# Altium project BartelsInterface.PrjPcb
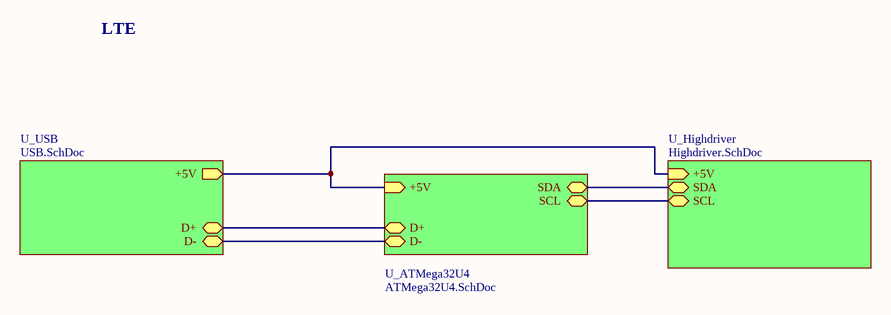
[diagram p0: Main.SchDoc]
4 sheets, 36 parts. Net scope: hierarchical (ports join the sheet entries above them; power ports are global).
Board file: PumpInterface.PcbDoc
Sheets:
  Main.SchDoc
    U_USB = USB.SchDoc
    U_ATMega32U4 = ATMega32U4.SchDoc
    U_Highdriver = Highdriver.SchDoc

## Sheet Main.SchDoc
size A4; SheetNumber: 1; SheetTotal: 4

### Parts
Bartunik  Gültig ab 5.3.18!!!  [lteLogoNeu_6mm]  (value not drawn)  (no BOM)

### Sub-sheets
U_ATMega32U4 = ATMega32U4.SchDoc: D+ (bidir), D- (bidir), SDA (bidir), SCL (bidir), +5V (in)
U_Highdriver = Highdriver.SchDoc: SCL (bidir), +5V (in), SDA (bidir)
U_USB = USB.SchDoc: D+ (bidir), D- (bidir), +5V (out)

### Nets
NetC_1.2_2: sheet U_USB/+5V, sheet U_ATMega32U4/+5V, sheet U_Highdriver/+5V
NetHeader1-14_5: sheet U_ATMega32U4/SDA, sheet U_Highdriver/SDA
NetHeader1-14_6: sheet U_ATMega32U4/SCL, sheet U_Highdriver/SCL
NetR_1.3_2: sheet U_USB/D+, sheet U_ATMega32U4/D+
NetR_1.4_2: sheet U_USB/D-, sheet U_ATMega32U4/D-

### Library data of the parts
Bartunik = ltelogoNEU: Manufactor: LTE; Part Number: ltelogoNEU; Supplier 1: LTE

## Sheet USB.SchDoc
size A4; SheetNumber: 3; SheetTotal: 4
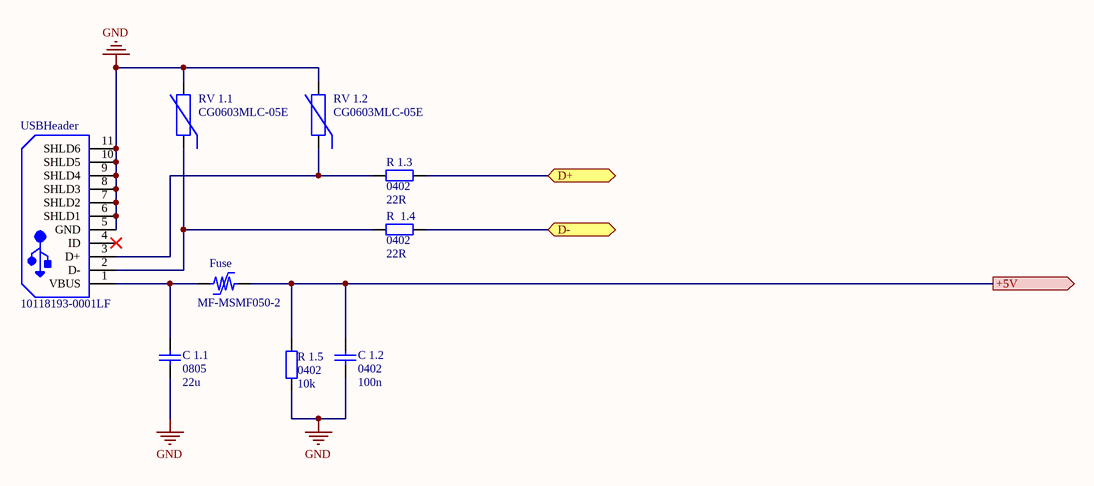
[diagram p1: USB.SchDoc]

### Parts
C_1.1  0805  value 22u  [C0805_M]
C_1.2  0402  value 100n  [C0402_M]
Fuse  MF-MSMF050-2  [BOUR-MF-MSMF050-2_V]
R_1.3  0402  value 22R  [R0402_M]
R_1.4  0402  value 22R  [R0402_M]
R_1.5  0402  value 10k  [R0402_M]
RV_1.1  CG0603MLC-05E  [BOUR-CG0603-2_V]
RV_1.2  CG0603MLC-05E  [BOUR-CG0603-2_V]
USBHeader  10118193-0001LF  [FCI-10118193-0001LF-5_V]

### Ports
+5V (out), D+ (bidir), D- (bidir)

### Nets
GND: C_1.1.1 C_1.2.1 R_1.5.1 RV_1.1.2 RV_1.2.2 USBHeader.5(GND) USBHeader.6(SHLD1) USBHeader.7(SHLD2) USBHeader.8(SHLD3) USBHeader.9(SHLD4) USBHeader.10(SHLD5) USBHeader.11(SHLD6)
NetC_1.1_2: C_1.1.2 Fuse.1 USBHeader.1(VBUS)
NetC_1.2_2: C_1.2.2 Fuse.2 R_1.5.2 ; port +5V
NetR_1.3_1: R_1.3.1 RV_1.2.1 USBHeader.3(D+)
NetR_1.3_2: R_1.3.2 ; port D+
NetR_1.4_1: R_1.4.1 RV_1.1.1 USBHeader.2(D-)
NetR_1.4_2: R_1.4.2 ; port D-

Not connected (* = marked no-connect by the designer): USBHeader 4(ID)*

### Library data of the parts
C_1.1 = C0805_X5R_22u_20%: Capacitor; Manufactor: Walsin; ManufactorPartNumber: 0805X226M6R3CT; Tech: MLCC X5R; VoltageRating: 6.3V; TempRating: -55°C to +125°C; Tolerance: 20%; Part Number: C0805_X5R_22u_20%; Type: Capacitor; Supplier 1: Farnell; Supplier Part Number 1: 2497053
C_1.2 = C0402_X7R_100n_10%: Capacitor; Manufactor: Yageo; ManufactorPartNumber: CC0402KRX7R7BB104; Tech: MLCC X7R; VoltageRating: 16V; TempRating: -55°C to +125°C; Tolerance: 10%; Part Number: C0402_X7R_100n_10%; Type: Capacitor; Supplier 1: Farnell; Supplier Part Number 1: 9402047
Fuse = CMP-2100-03653-1: PTC Resettable Fuse, 15 V, 500 mA, -40 to 85 degC, 2-Pin SMD, RoHS, Tape and Reel; Manufacturer: Bourns; Voltage Rating (DC): 15V; Max Current Rating: 100A; Power Dissipation: 800mW; Resistance: 150mOhm; Width: 3.41mm; Package Quantity: 2000; Voltage Rating: 15V; RoHSCompliant: true; Contact Plating: Gold; REACH SVHC: NoSVHC; Datasheet URL: http://www.bourns.com/docs/Product-Datasheets/mfmsmf.pdf; Lead Free: LeadFree; Height: 0.85mm; Min Operating Temperature: -40degC; Case Code (Metric): 4532; Number of Terminals: 2; Case Code (Imperial): 1812; Case/Package: 1812; Current Rating: 100A; Length: 4.73mm; Max Operating Temperature: 85degC; Package Reference: MF-MSMF050-2; Radiation Hardening: No; Datasheet Version: Rev. AG, 08/2016; Packaging: TapeandReel; Termination: SMD/SMT; Supply Voltage: 15V; Manufacturer URL: http://www.bourns.com/; Mount: SurfaceMount; Package Description: 2-Pin Surface Mount Device, Body 4.55 x 3.24 mm
R_1.3 R_1.4 = R0402_1%_220R: Resistor; Manufactor: Vishay; ManufactorPartNumber: CRCW0402220RFKEDHP; Tech: Dickschicht; VoltageRating: 50V; PowerRating: 0,125W; Tolerance: 1%; Part Number: R0402_1%_220R; Type: Resistor
R_1.5 = R0402_1%_10k: Resistor; Manufactor: Vishay; ManufactorPartNumber: CRCW040210K0FKEDHP; Tech: Dickschicht; VoltageRating: 50V; PowerRating: 0,125W; Tolerance: 1%; Part Number: R0402_1%_10k; Type: Resistor; Supplier 1: Digi-Key; Supplier Part Number 1: 541-10.0KYCT-ND; Supplier 2: Farnell; Supplier Part Number 2: 1738864
RV_1.1 RV_1.2 = CMP-0584-00001-2: ESD Protector, 5 V Supply, -40 to 85 degC, 1.6 x 0.8 x 0.55 mm SMD, RoHS, Tape and Reel; Manufacturer: Bourns; VC: 20 V; VT: 150 V; RT: 1 ns; VDC: 5 V; CO: 0.5 pF; PartNumber: CG0603MLC-05E; ComponentLink1Description: Manufacturer URL; ComponentLink1URL: http://www.bourns.com/; Packing: Tape and Reel; Mounting Technology: Surface Mount; ComponentLink2Description: Datasheet; RoHS: TRUE; Operating Temperature: -40 to 85 degC; DatasheetVersion: Rev. S; PackageDescription: 2-Pin SMD, Body 1.6 x 0.8 mm, Pitch 1.52 mm; PackageReference: CG0603-2; ComponentLink2URL: http://www.bourns.com/data/global/pdfs/MLC.pdf
USBHeader = CMP-2000-05119-1: Micro USB B Type Receptacle, -55 to 85 degC, 5-Pin SMD, RoHS, Tape and Reel; Manufacturer: FCI; Insulation Resistance: 1000MOhms; Gender: Female; Current Rating: 1.8A; Number of Contacts: 5Contact; Connector Type: MicroUSBTypeBreceptacle; Mounting Angle: Right; Datasheet Version: Rev. C, 05/2015; Packaging: Reel; Product Category: USBConnectors; Standard: USB2.0; Factory Pack Quantity: 1200; Operating Temperature Range: -55Cto+85C; Termination Style: SMD/SMT; Datasheet URL: http://datasheet.octopart.com/10118193-0001LF-FCI-datasheet-55953155.pdf; Contact Material: CopperAlloy; RoHS: Details; Contact Plating: Gold; Flammability Rating: UL94V-0; Manufacturer URL: http://www.fci.com/; Brand: FCI; Product: MicroUSBTypeBConnectors; Color: Black

## Sheet ATMega32U4.SchDoc
size A4; SheetNumber: 2; SheetTotal: 4
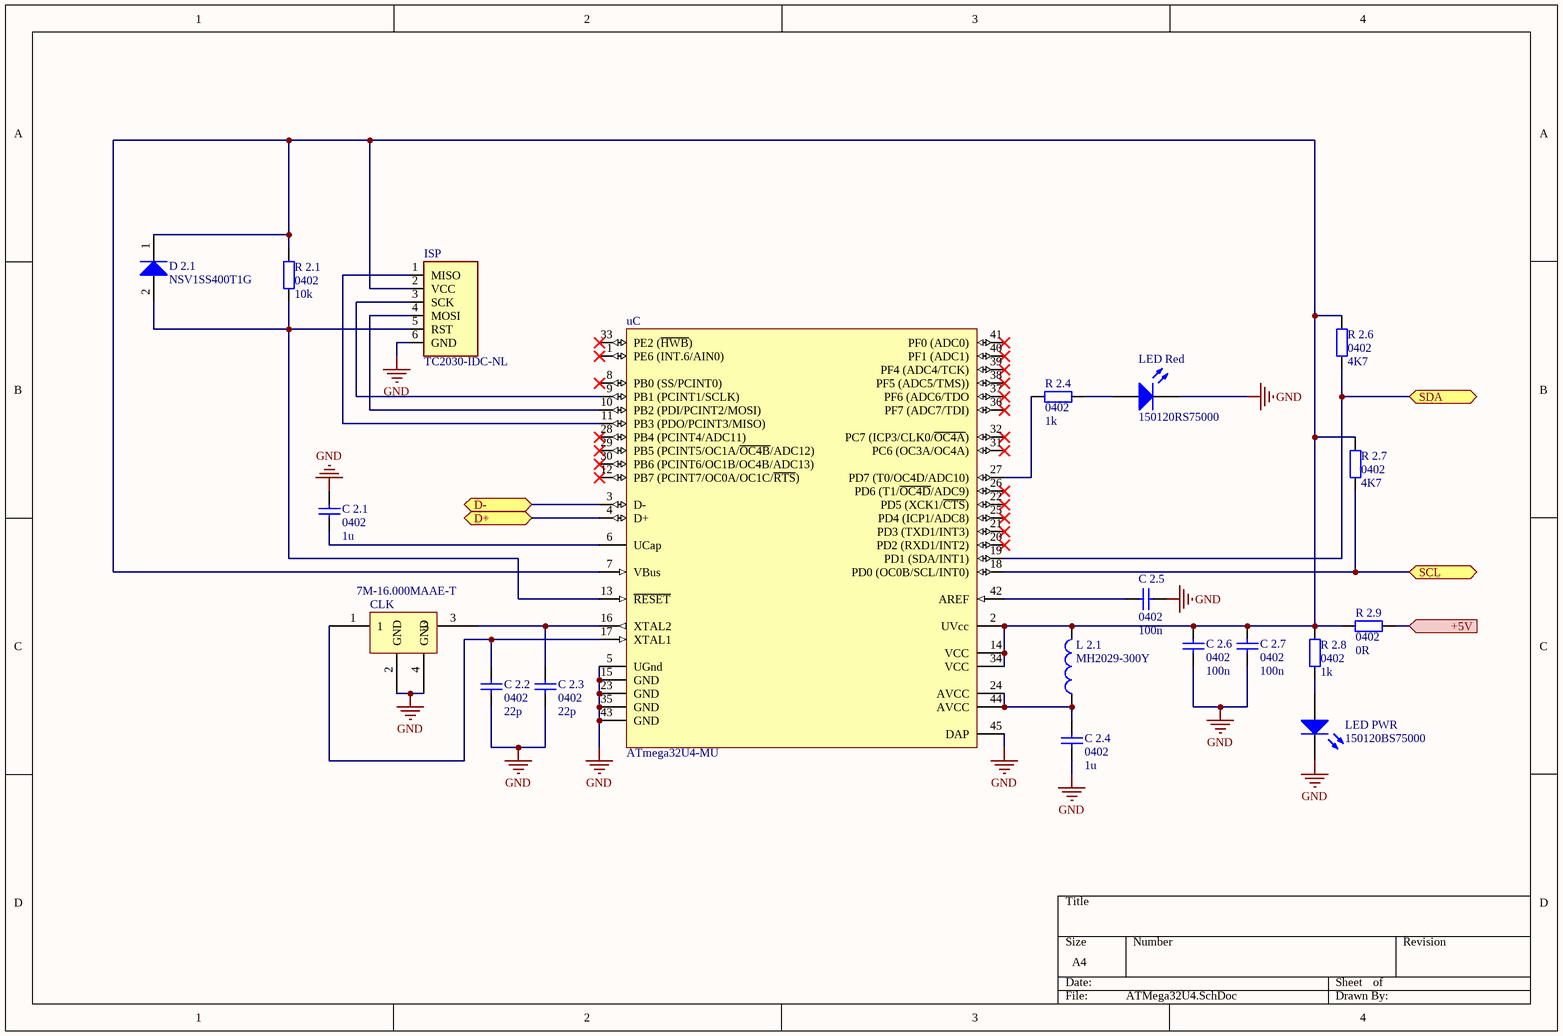
[diagram p2: ATMega32U4.SchDoc]

### Parts
C_2.1  0402  value 1u  [C0402_M]
C_2.2  0402  value 22p  [C0402_M]
C_2.3  0402  value 22p  [C0402_M]
C_2.4  0402  value 1u  [C0402_M]
C_2.5  0402  value 100n  [C0402_M]
C_2.6  0402  value 100n  [C0402_M]
C_2.7  0402  value 100n  [C0402_M]
CLK  7M-16.000MAAE-T  [7M-16.000MAAE-T]
D_2.1  NSV1SS400T1G  [ONSC-SOD-523-2-502-01_V]
ISP  TC2030-IDC-NL  [TAG_TC2030-IDC-NL]
L_2.1  MH2029-300Y  [L0805_M]
LED_PWR  150120BS75000  [1206_A]
LED_Red  150120RS75000  [1206_A]
R_2.1  0402  value 10k  [R0402_M]
R_2.4  0402  value 1k  [R0402_M]
R_2.6  0402  value 4K7  [R0402_M]
R_2.7  0402  value 4K7  [R0402_M]
R_2.8  0402  value 1k  [R0402_M]
R_2.9  0402  value 0R  [R0402_M]
uC  ATmega32U4-MU  [44PW_M]

### Ports
+5V (in), D+ (bidir), D- (bidir), SCL (bidir), SDA (bidir)

### Nets
GND: C_2.1.2 C_2.2.1 C_2.3.1 C_2.4.1 C_2.5.2 C_2.6.1 C_2.7.1 CLK.2(GND) CLK.4(GND) ISP.6(GND) LED_PWR.1(K) LED_Red.1(K) uC.5(UGnd) uC.15(GND) uC.23(GND) uC.35(GND) uC.43(GND) uC.45(DAP)
NetC_1.2_2: R_2.9.2 ; port +5V
NetC_2.1_1: C_2.1.1 uC.6(UCap)
NetC_2.2_2: C_2.2.2 CLK.1 uC.17(XTAL1)
NetC_2.3_2: C_2.3.2 CLK.3 uC.16(XTAL2)
NetC_2.4_2: C_2.4.2 L_2.1.1 uC.24(AVCC) uC.44(AVCC)
NetC_2.5_1: C_2.5.1 uC.42(AREF)
NetC_2.6_2: C_2.6.2 C_2.7.2 D_2.1.1(K) ISP.2(VCC) L_2.1.2 R_2.1.2 R_2.6.2 R_2.7.2 R_2.8.2 R_2.9.1 uC.2(UVcc) uC.7(VBus) uC.14(VCC) uC.34(VCC)
NetD_2.1_2: D_2.1.2(A) ISP.5(RST) R_2.1.1 uC.13(~{RESET})
NetHeader1-14_5: R_2.6.1 uC.19(PD1_(SDA/INT1)) ; port SDA
NetHeader1-14_6: R_2.7.1 uC.18(PD0_(OC0B/SCL/INT0)) ; port SCL
NetISP_1: ISP.1(MISO) uC.11(PB3_(PDO/PCINT3/MISO))
NetISP_3: ISP.3(SCK) uC.9(PB1_(PCINT1/SCLK))
NetISP_4: ISP.4(MOSI) uC.10(PB2_(PDI/PCINT2/MOSI))
NetLED_PWR_2: LED_PWR.2(A) R_2.8.1
NetLED_Red_2: LED_Red.2(A) R_2.4.1
NetR_1.3_2: uC.4(D+) ; port D+
NetR_1.4_2: uC.3(D-) ; port D-
NetR_2.4_2: R_2.4.2 uC.27(PD7_(T0/OC4D/ADC10))

Not connected (* = marked no-connect by the designer): uC 1(PE6_(INT.6/AIN0))* 8(PB0_(SS/PCINT0))* 12(PB7_(PCINT7/OC0A/OC1C/~{RTS}))* 20(PD2_(RXD1/INT2))* 21(PD3_(TXD1/INT3))* 22(PD5_(XCK1/~{CTS}))* 25(PD4_(ICP1/ADC8))* 26(PD6_(T1/~{OC4D}/ADC9))* 28(PB4_(PCINT4/ADC11))* 29(PB5_(PCINT5/OC1A/~{OC4B}/ADC12))* 30(PB6_(PCINT6/OC1B/OC4B/ADC13))* 31(PC6_(OC3A/OC4A))* 32(PC7_(ICP3/CLK0/~{OC4A}))* 33(PE2_(~{HWB}))* 36(PF7_(ADC7/TDI))* 37(PF6_(ADC6/TDO)* 38(PF5_(ADC5/TMS)))* 39(PF4_(ADC4/TCK))* 40(PF1_(ADC1))* 41(PF0_(ADC0))*

### Library data of the parts
C_2.1 C_2.4 = C0402_X5R_1u_10V_WE: Capacitor; Manufactor: WURTH ELEKTRONIK; ManufactorPartNumber: 885012105012; Tech: X5R; VoltageRating: 10V; TempRating: -55°C to +125°C; Tolerance: ±20%; Part Number: C0402_X5R_1u_10V_WE; Type: Capacitor; Supplier 1: Digi-Key; Supplier Part Number 1: 732-7489-1-ND
C_2.2 C_2.3 = C0402_NP0_22p_50V_WE: Capacitor; Manufactor: WURTH ELEKTRONIK; ManufactorPartNumber: 885012005057; Tech: NP0; VoltageRating: 50V; TempRating: -55°C to +125°C; Tolerance: ±5%; Part Number: C0402_NP0_22p_50V_WE; Type: Capacitor; Supplier 1: Digi-Key; Supplier Part Number 1: 732-7471-1-ND
C_2.5-C_2.7 = C0402_X7R_100n_10%: as C_1.2 on sheet USB; Part Number: C0402_X7R_100n_10%; Type: Capacitor; Supplier 1: Farnell; Supplier Part Number 1: 9402047
D_2.1 = CMP-1054-00078-1: High-Speed Switching Diode, 2-Pin SOD-523, Pb-Free, Tape and Reel; Manufacturer: On Semiconductor; IF Max (A): 0.2; Configuration: Single; trr Max (ns): 4; ComponentLink3URL: http://www.onsemi.com/pub_link/Collateral/502-01.PDF; PackageDescription: 2-Pin SOD, Body 1.2 x 0.8 mm; ComponentLink1URL: http://www.onsemi.com/; Mounting Technology: Surface Mount; ComponentLink1Description: Manufacturer URL; DatasheetVersion: Rev. 7; Packing: Tape and Reel; PackageVersion: Rev. E, 09/2010; RoHS: TRUE; PartNumber: NSV1SS400T1G; PackageReference: SOD-523-2-502-01; ComponentLink3Description: Package Specification; ComponentLink2Description: Datasheet; ComponentLink2URL: http://www.onsemi.com/pub_link/Collateral/1SS400T1-D.PDF
ISP = TC2030-IDC-NL: 6-PIN PLUG-OF-NAILS CABLE 6; MF: Tag-Connect; Package: Package Analog Devices; Availability: Unavailable; Value: *; MP: TC2030-IDC-NL; SnapEDA_Link: https://www.snapeda.com/parts/TC2030-IDC-NL/Tag-Connect/view-part/2783029/?ref=snap; Price: None
L_2.1 = L0805_100n_2%: Manufactor: Coilcraft; ManufactorPartNumber: 0805CS-101XJLC; Kind: General; Value: 100n; CurrentRating: 400mA; TempRating: -40°C bis 125°C; Tolerance: 2%; Part Number: L0805_100n_2%; Supplier 1: Farnell; Supplier Part Number 1: 2286419
LED_PWR = CMP-1426-00015-1: SMD mono-color Chip LED, WL-SMCW, Blue; Manufacturer: Wuerth Elektronik; ComponentLink2Description: Datasheet; ComponentLink1URL: http://www.we-online.com; PartNumber: 150120BS75000; ComponentLink1Description: Manufacturer URL; ComponentLink2URL: http://katalog.we-online.com/led/datasheet/150120BS75000.pdf; PackageReference: 1206_A; Color: Blue
LED_Red = CMP-1426-00013-1: SMD mono-color Chip LED, WL-SMCW, Red; Manufacturer: Wuerth Elektronik; Color: Red; ComponentLink2URL: http://katalog.we-online.com/led/datasheet/150120RS75000.pdf; ComponentLink2Description: Datasheet; ComponentLink1Description: Manufacturer URL; ComponentLink1URL: http://www.we-online.com; PartNumber: 150120RS75000; PackageReference: 1206_A
R_2.1 = R0402_1%_10k: as R_1.5 on sheet USB; Part Number: R0402_1%_10k; Type: Resistor; Supplier 1: Digi-Key; Supplier Part Number 1: 541-10.0KYCT-ND; Supplier 2: Farnell; Supplier Part Number 2: 1738864
R_2.4 R_2.8 = R0402_1%_1k: Resistor; Manufactor: Vishay; ManufactorPartNumber: CRCW04021K00FKED; Tech: Dickschicht; VoltageRating: 50V; PowerRating: 0,063W; Tolerance: 1%; Part Number: R0402_1%_1k; Type: Resistor; Supplier 1: Digi-Key; Supplier Part Number 1: 541-1.00KLCT-ND; Supplier 2: Farnell; Supplier Part Number 2: 1469662
R_2.6 R_2.7 = R0402_1%_3k3: Resistor; Manufactor: Yageo; ManufactorPartNumber: RC0402FR-073K3L; Tech: Dickschicht; VoltageRating: 50V; PowerRating: 0,0625W; Tolerance: 1%; Part Number: R0402_1%_3k3; Type: Resistor
R_2.9 = R0402_1%_0R: Resistor; Manufactor: Multicomp; ManufactorPartNumber: MC00625W040210R; Tech: Dickschicht; VoltageRating: 50V; PowerRating: 0,0625W; Tolerance: 1%; Part Number: R0402_1%_0R; Type: Resistor; Supplier 1: Farnell; Supplier Part Number 1: 1357983
uC = CMP-0095-00166-2: 8-bit AVR Microcontroller, 2.7-5.5V, 16MHz, 32KB Flash, 1KB EEPROM, 2.5KB SRAM, USB Controller, 44-pin QFN, Industrial Grade (-40°C to 85°C), Ext Osc; PackageVersion: revG, Sep-2009; PackageReference: 44PW; ComponentLink1URL: http://www.atmel.com/; PackageDescription: 44-Pin Quad Flat No-Lead Package, 7 x 7 mm Body, 0.5 mm Pitch (QFN); ComponentLink3Description: ATmega16U4 ATmega32U4 Summary; RevisionNote: DatasheetVersion, PackageVersion & PCB updated. URLs added.; ComponentLink2Description: ATmega16U4/32U4 Datasheet; ComponentLink1Description: Manufacturer URL; ComponentLink3URL: http://www.atmel.com/dyn/resources/prod_documents/7766S.pdf; DatasheetVersion: revF, Nov-2010; ComponentLink2URL: http://www.atmel.com/dyn/resources/prod_documents/doc7766.pdf; Code_JEDEC: MO-220-VKKD-1

## Sheet Highdriver.SchDoc
size A4; SheetNumber: 4; SheetTotal: 4
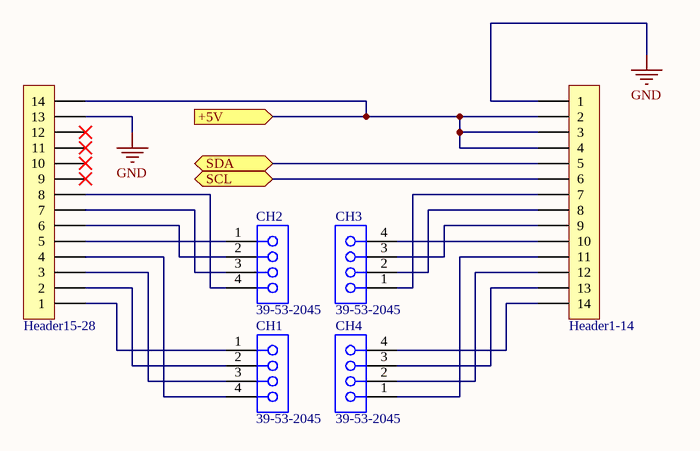
[diagram p3: Highdriver.SchDoc]

### Parts
CH1  39-53-2045  [MOLX-39-53-2045]
CH2  39-53-2045  [MOLX-39-53-2045]
CH3  39-53-2045  [MOLX-39-53-2045]
CH4  39-53-2045  [MOLX-39-53-2045]
Header1-14  PH1x14  [PH2,54mm-1x14]  (value not drawn)
Header15-28  PH1x14  [PH2,54mm-1x14]  (value not drawn)

### Ports
+5V (in), SCL (bidir), SDA (bidir)

### Nets
GND: Header1-14.1 Header15-28.13
NetC_1.2_2: Header1-14.2 Header1-14.3 Header1-14.4 Header15-28.14 ; port +5V
NetCH1_1: CH1.1 Header15-28.1
NetCH1_2: CH1.2 Header15-28.2
NetCH1_3: CH1.3 Header15-28.3
NetCH1_4: CH1.4 Header15-28.4
NetCH2_1: CH2.1 Header15-28.5
NetCH2_2: CH2.2 Header15-28.6
NetCH2_3: CH2.3 Header15-28.7
NetCH2_4: CH2.4 Header15-28.8
NetCH3_1: CH3.1 Header1-14.7
NetCH3_2: CH3.2 Header1-14.8
NetCH3_3: CH3.3 Header1-14.9
NetCH3_4: CH3.4 Header1-14.10
NetCH4_1: CH4.1 Header1-14.11
NetCH4_2: CH4.2 Header1-14.12
NetCH4_3: CH4.3 Header1-14.13
NetCH4_4: CH4.4 Header1-14.14
NetHeader1-14_5: Header1-14.5 ; port SDA
NetHeader1-14_6: Header1-14.6 ; port SCL

Not connected (* = marked no-connect by the designer): Header15-28 9* 10* 11* 12*

### Library data of the parts
CH1-CH4 = CMP-1242-00004-1: 1.25 mm Pitch FPC Connector, 7.5 mm Mated Height, Vertical, ZIF, Through Hole, 4 Circuits, -20 to 80 degC, ELV and RoHS Compliant, Tray; Manufacturer: Molex; Material - Metal: Phosphor Bronze; Circuits (Loaded): 4; Polarized to PCB: No; PCB Retention: None; Pitch - Mating Interface: 1.25mm; Durability (mating cycles max): 30; Mated Height: 7.50mm; Current (Max per Contact): 1A; Voltage (Max): 200V; Material - Plating Termination: Tin-Bismuth; PackageVersion: Rev. A, 12/2004; PackageDescription: 4-Lead FPC Connector, Pitch 1.25 mm; PackageReference: 39-53-2045; PartNumber: 39-53-2045; ComponentLink3URL: http://www.molex.com/pdm_docs/sd/039532045_sd.pdf; ComponentLink3Description: Package Specification; ComponentLink1Description: Manufacturer URL; Contact Position: N/A; Entry Angle: Vertical; ComponentLink1URL: http://www.molex.com/molex/index.jsp; Stackable: No; RoHS: TRUE; ComponentLink2URL: http://www.molex.com/webdocs/datasheets/pdf/en-us/0039532045_FFC_FPC_CONNECTORS.pdf; Packing: Tray; Mounting Technology: Through Hole; PCB Locator: No; Orientation: Vertical; ComponentLink2Description: Datasheet; Number of Rows: 1; Material - Plating Mating: Tin-Bismuth
Header1-14 Header15-28 = PH2,54mm-1x14: Part Number: PH2,54mm-1x14

## Nets that join several sheets
GND: USB (12 pins), ATMega32U4 (18 pins), Highdriver (Header1-14.1 Header15-28.13)
NetC_1.2_2: USB (C_1.2.2 Fuse.2 R_1.5.2), ATMega32U4 (R_2.9.2), Highdriver (Header1-14.2 Header1-14.3 Header1-14.4 Header15-28.14)
NetHeader1-14_5: ATMega32U4 (R_2.6.1 uC.19), Highdriver (Header1-14.5)
NetHeader1-14_6: ATMega32U4 (R_2.7.1 uC.18), Highdriver (Header1-14.6)
NetR_1.3_2: USB (R_1.3.2), ATMega32U4 (uC.4)
NetR_1.4_2: USB (R_1.4.2), ATMega32U4 (uC.3)